# Altium schematic sheet Gatetreiber.SchDoc
size A4; SheetNumber: 4; SheetTotal: 7
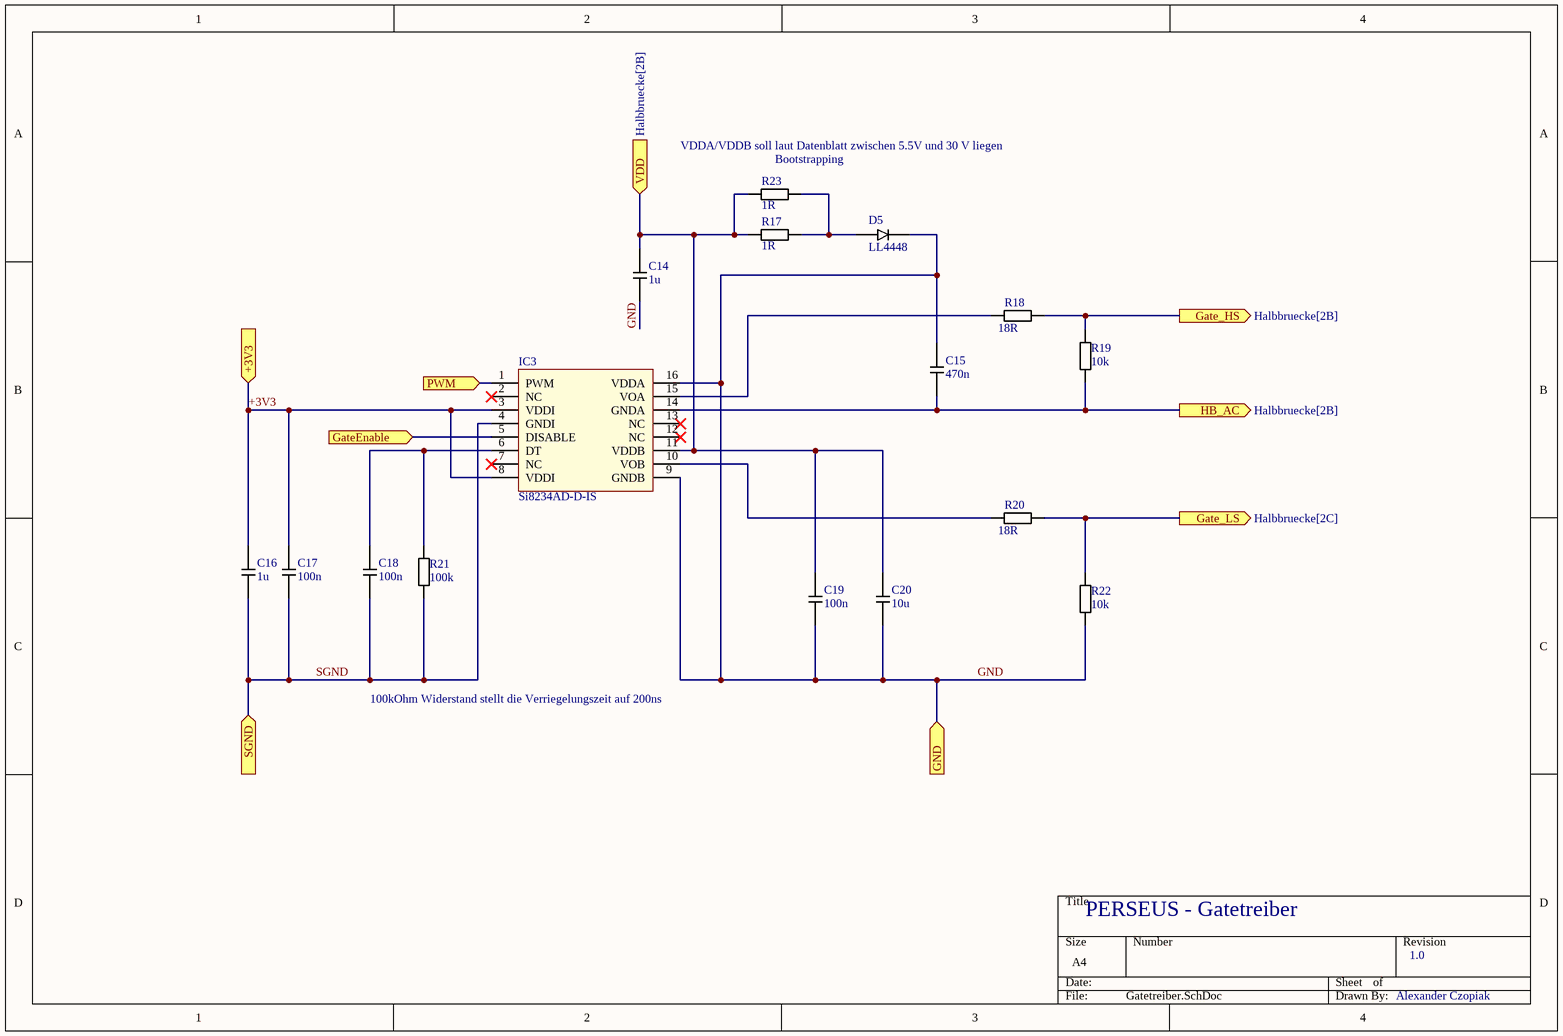
[diagram p0: Gatetreiber.SchDoc]

## Parts
C14  1u  [1206_C]
C15  470n  [1206_C]
C16  1u  [1206_C]
C17  100n  [1206_C]
C18  100n  [1206_C]
C19  100n  [1206_C]
C20  10u  [1206_C]
D5  LL4448  [MINIMELF-SOD80]
IC3  Si8234AD-D-IS  [SO16_W]
R17  1R  [1206_R]
R18  18R  [1206_R]
R19  10k  [1206_R]
R20  18R  [1206_R]
R21  100k  [1206_R]
R22  10k  [1206_R]
R23  1R  [1206_R]

## Ports
+3V3 (in, see Halbbruecke[2B], Hochsetzsteller[2A], SpannungssensorTP[4B], StromsensorTP[3B]), Gate_HS (out, see Halbbruecke[2B]), Gate_LS (out, see Halbbruecke[2C]), GateEnable (in, see Halbbruecke[1C]), GND (in, see Halbbruecke[2C], Halbbruecke[3D], Hochsetzsteller[3D]), HB_AC (out, see Halbbruecke[2B]), PWM (in, see Halbbruecke[1B]), SGND (in, see Halbbruecke[2C], Halbbruecke[2D], Hochsetzsteller[3D], SpannungssensorTP[3C], StromsensorTP[3C]), VDD (in, see Halbbruecke[2B])

## Nets
+3V3: C16.2 C17.2 IC3.3(VDDI) IC3.8(VDDI) ; port +3V3
Gate_HS: R18.2 R19.1 ; port Gate_HS
Gate_LS: R20.2 R22.2 ; port Gate_LS
GateEnable: IC3.5(DISABLE) ; port GateEnable
GND: C14.1 C15.2 C19.1 C20.1 D5.2(K) IC3.9(GNDB) IC3.16(VDDA) R22.1 ; port GND
HB_AC: C15.1 IC3.14(GNDA) R19.2 ; port HB_AC
PWM: IC3.1(PWM) ; port PWM
SGND: C16.1 C17.1 C18.1 IC3.4(GNDI) R21.1 ; port SGND
VDD: C14.2 C19.2 C20.2 IC3.11(VDDB) R17.1 R23.1 ; port VDD
NetC18_2: C18.2 IC3.6(DT) R21.2
NetD5_1: D5.1(A) R17.2 R23.2
NetIC3_10: IC3.10(VOB) R20.1
NetIC3_15: IC3.15(VOA) R18.1

Not connected (* = marked no-connect by the designer): IC3 2(NC)* 7(NC)* 12(NC)* 13(NC)*

## Notes on the sheet
- (near R23) VDDA/VDDB soll laut Datenblatt zwischen 5.5V und 30 V liegen
- (near R23) Bootstrapping
- 100kOhm Widerstand stellt die Verriegelungszeit auf 200ns
- PERSEUS - Gatetreiber
- 1.0
- Alexander Czopiak

## Library data of the parts
C14-C20 = CAP: Kondensator (ohne Polarität)
D5 = DIODE: Diode (z.B. 1N4448)
IC3 = Si8234AD-D-IS: Gate-Treiber 5 kV 5 V UVLO HS/LS isolated gate driver with PWM input, deadtime with external resistor; EBS_Nummer: 8717; HelpURL: https://ebs.eti.kit.edu/Artikel/Detailansicht/8717
R17-R23 = WIDERSTAND